# EasyEDA Pro project ProProject_zelda_guardian.epro, schematic Schematic1
Create Date: 2023-06-21; Page Name: P1; Project Name: zelda_guardian; Schematic Name: Schematic1; Update Date: 2023-06-22; Company: 嘉立创EDA; Page Size: A4; Version: V1.0
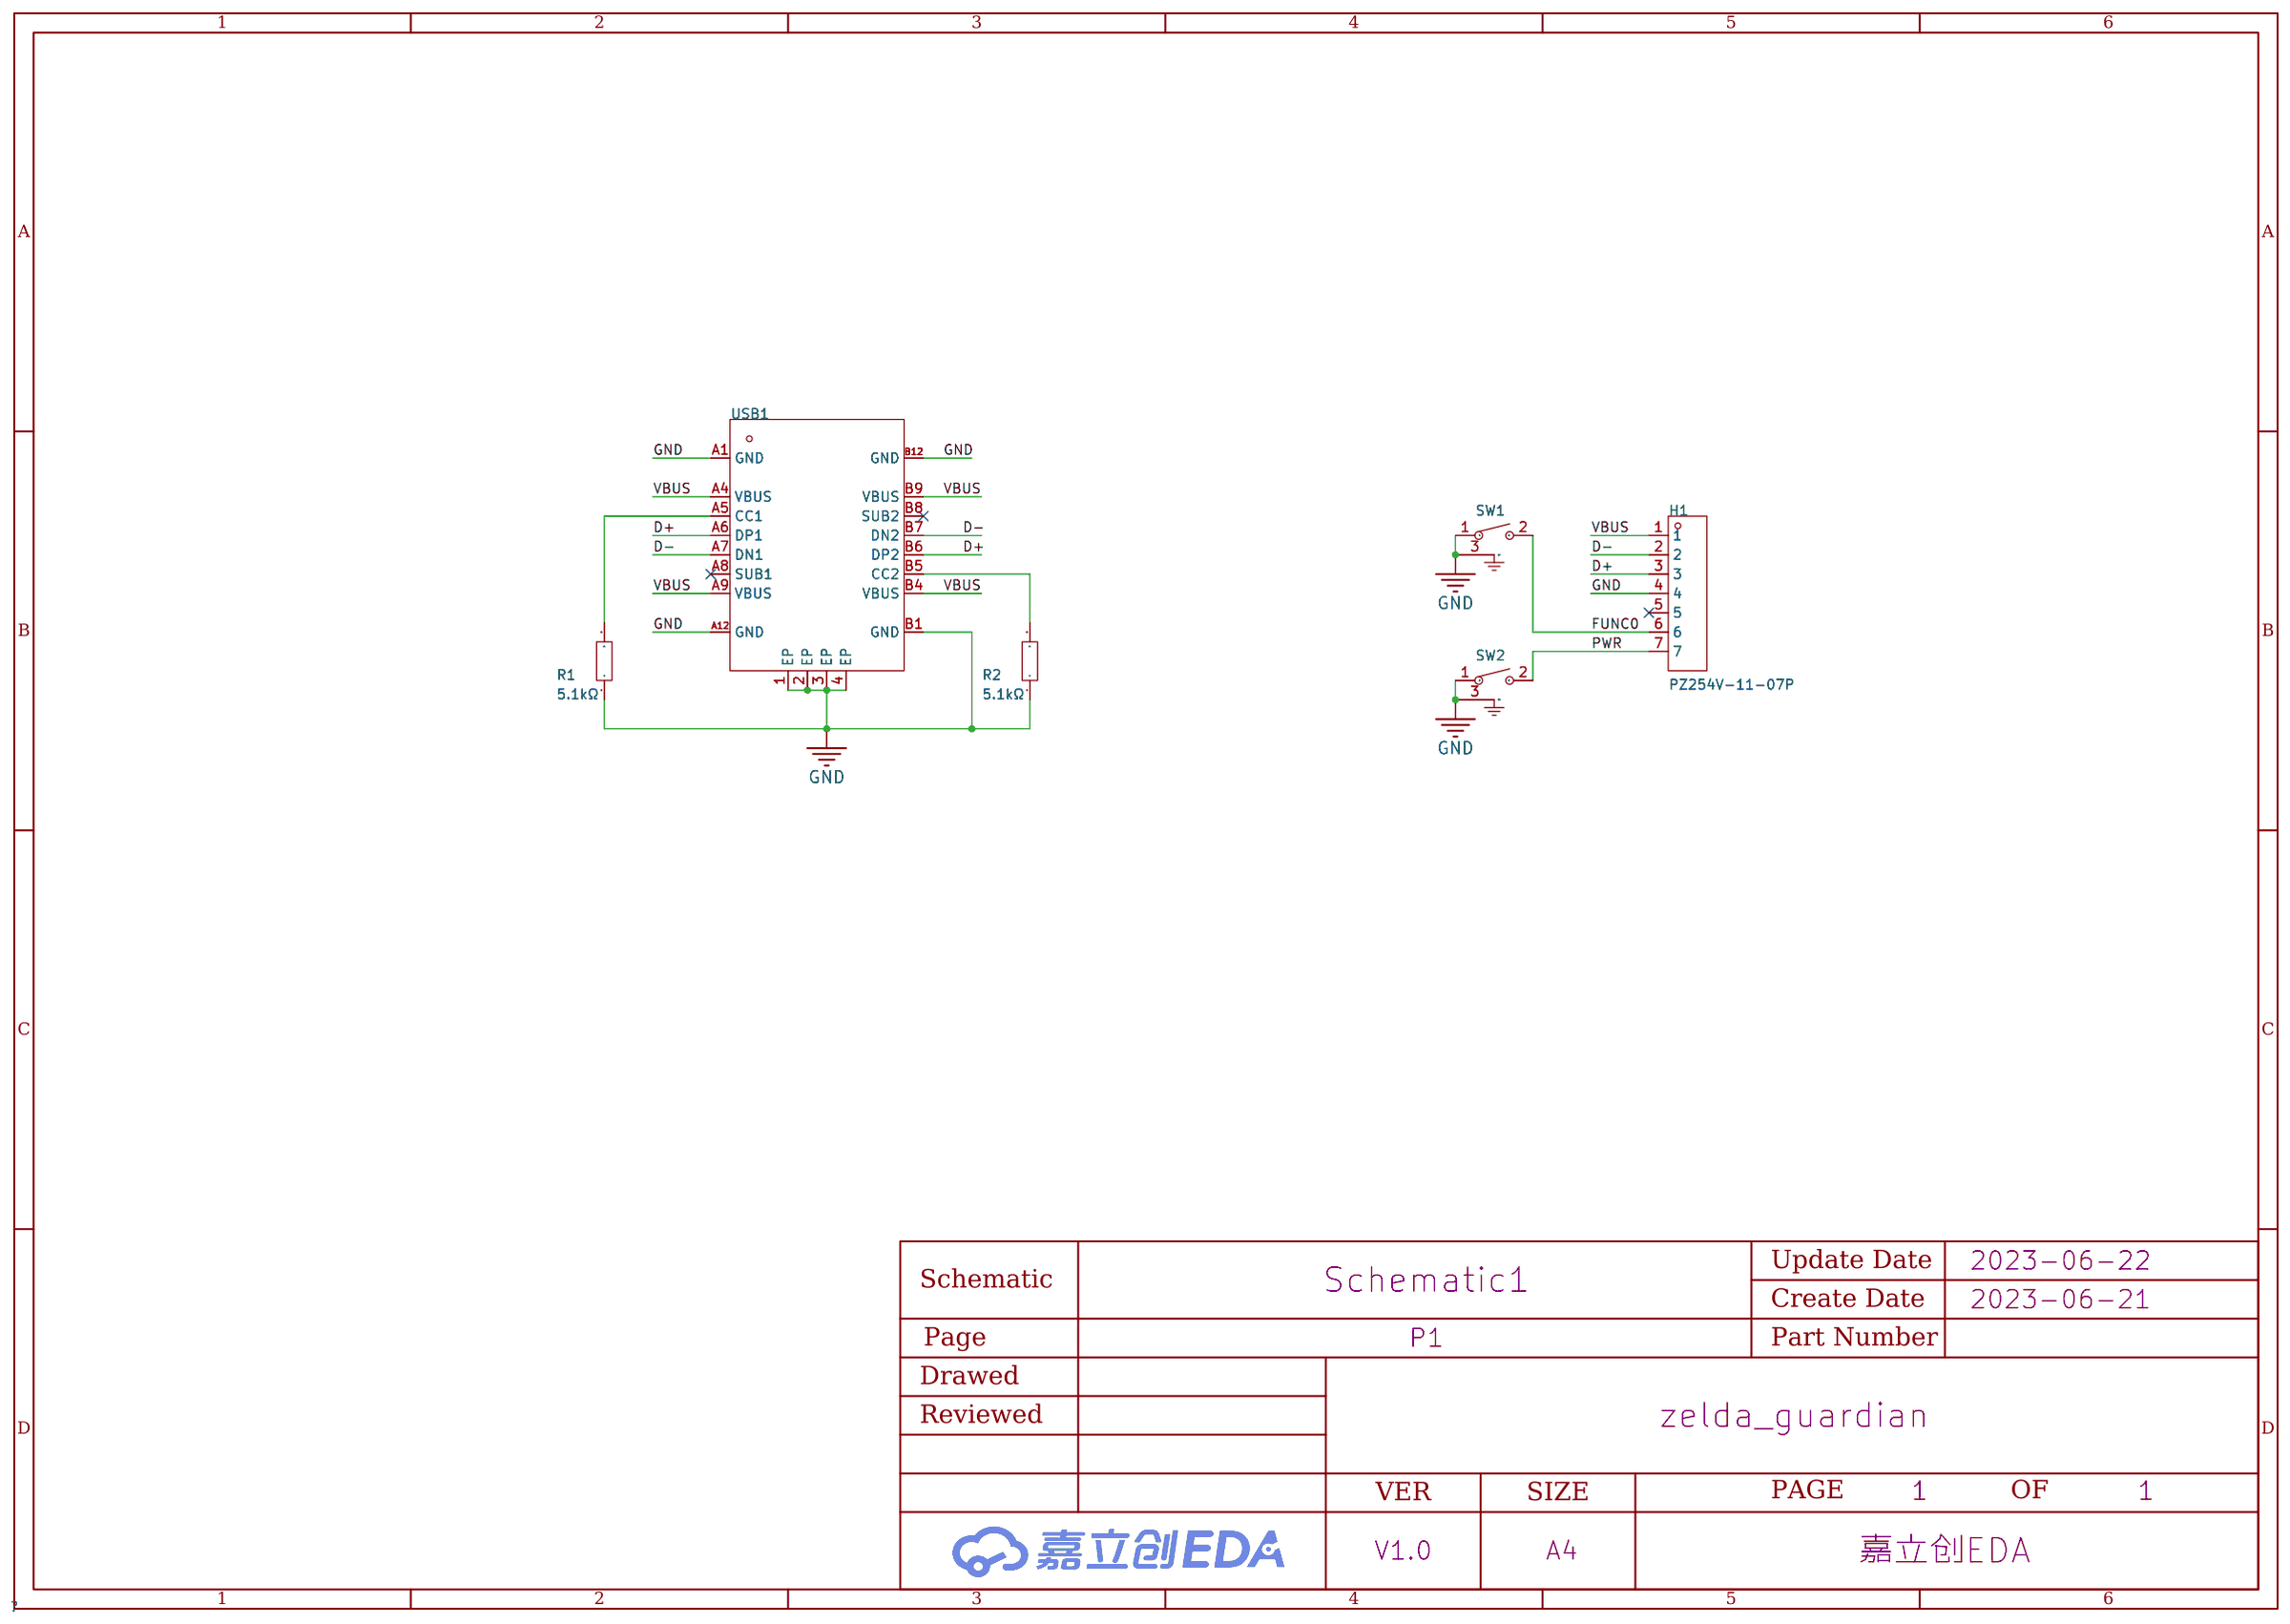
[diagram p5: schematic sheet]

## Parts
H1  PZ254V-11-07P  [HDR-TH_7P-P2.54-V-M]
R1  5.1kΩ  [R0603]
R2  5.1kΩ  [R0603]
SW1  TS-1091B-A10B3-D2  [SW-TH_TS-1091B-A10B3-D2]
SW2  TS-1091B-A10B3-D2  [SW-TH_TS-1091B-A10B3-D2]
USB1  KH-TYPE-C-16P  [USB-C-SMD_KH-TYPE-C-16P]

## Library data of the parts
H1 = 7P: 排数:单排;总PIN位数:7;间距:2.54mm;插针结构:1x7P;行距:-;安装类型:直插;圆针/方针:方针;额定电流:-;额定电压:-;配合针长度:6mm;塑高:2.5mm;端接针长度:3mm;触头材质:黄铜;触头镀层:-;工作温度范围:-40℃~+105℃;颜色:黑色;; LCSC Part Name: 2.54mm 1x7P 直插 方针; Supplier Part: C492406; Manufacturer: XFCN(兴飞); Supplier Footprint: 直插,P=2.54mm; JLCPCB Part Class: Extended Part; Datasheet: https://atta.szlcsc.com/upload/public/pdf/source/20200309/C492406_654C533EE691117E22DD9F76C114C2D9.pdf; Supplier: LCSC; Number of Rows: 单排; Number of Pins: 7; Pitch: 2.54mm; Pin Structure: 1x7P; Mounting Type: 直插; Circluar Pins/Square Pins: 方针; Length of Mating Pin: 6mm; Insulation Height: 2.5mm; Length of End Connection Pin: 3mm; Contact Material: 黄铜; Operating Temperature Range: -40℃~+105℃; Color: 黑色
R1 R2 = 0603WAF5101T5E: 电阻类型:厚膜电阻;阻值:5.1kΩ;精度:±1%;功率:100mW;; LCSC Part Name: 5.1kΩ ±1% 100mW; Supplier Part: C23186; Manufacturer: UNI-ROYAL(厚声); Supplier Footprint: 0603; JLCPCB Part Class: Basic Part; Datasheet: https://atta.szlcsc.com/upload/public/pdf/source/20200306/C422600_1E6D84923E4A46A82E41ADD87F860B5C.pdf; Supplier: LCSC; Type: 厚膜电阻; Tolerance: ±1%; Power(Watts): 100mW; Temperature Coefficient: ±100ppm/℃; Overload Voltage (Max): 75V; Operating Temperature Range: -55℃~+155℃
SW1 SW2 = TS-1091B-A10B3-D2: 电路结构:单刀单掷;安装方式:卧插;作用力:250gf@±30gf;机械寿命:-;带支架:否;; LCSC Part Name: 4.5*4.5*8mm 卧插 轻触开关; Supplier Part: C557916; Manufacturer: Yuandi(元迪); Supplier Footprint: 插件; JLCPCB Part Class: Extended Part; Datasheet: https://atta.szlcsc.com/upload/public/pdf/source/20200522/C557907_5E276C0BAE06263EE04F5DF3713DC068.pdf; Supplier: LCSC; Circuit: 单刀单掷; Mounting Style: 卧插; Actuator Style: 圆形按钮; Actuator/Cap Color: 黑色; Operating Force: 250gf@±30gf; Pin Style: PC引脚; Switch Length: 4.5mm; Switch Width: 4.5mm; Switch Height: 8mm; Strike Gundam: 否
USB1 = KH-TYPE-C-16P: 连接器类型:Type-C;标准:-;公母:母座;触点数量:16;端口数量:1;安装方式:卧贴;额定电流 - 电源:3A;工作温度范围:-40℃~+85℃;; LCSC Part Name: Type-C 母座 卧贴; Supplier Part: C709357; Manufacturer: kinghelm(金航标); Supplier Footprint: SMD; JLCPCB Part Class: Extended Part; Datasheet: https://atta.szlcsc.com/upload/public/pdf/source/20200911/C709357_AA8DCEB38BB20E3035A7ED7AE7667837.pdf; Supplier: LCSC; Connector Type: Type-C; Gender: 母座; Number of Contacts: 16; Number of Ports: 1; Mounting Style: 卧贴; Current Rating - Power (Max): 3A; Operating Temperature Range: -40℃~+85℃

## Nets
GND: H1.4 R1.1 R2.1 SW1.1 SW1.3(GND) SW2.1 SW2.3(GND) USB1.1(EP) USB1.2(EP) USB1.3(EP) USB1.4(EP) USB1.A1(GND) USB1.A12(GND) USB1.B1(GND) USB1.B12(GND)
VBUS: H1.1 USB1.A4(VBUS) USB1.A9(VBUS) USB1.B4(VBUS) USB1.B9(VBUS)
D+: H1.3 USB1.A6(DP1) USB1.B6(DP2)
D-: H1.2 USB1.A7(DN1) USB1.B7(DN2)
FUNC0: H1.6 SW1.2
PWR: H1.7 SW2.2
$1N401: R2.2 USB1.B5(CC2)
$1N402: R1.2 USB1.A5(CC1)

Not connected (* = marked no-connect by the designer): H1 5*; USB1 A8(SUB1)* B8(SUB2)*
